# Altium schematic sheet main.SchDoc
size A
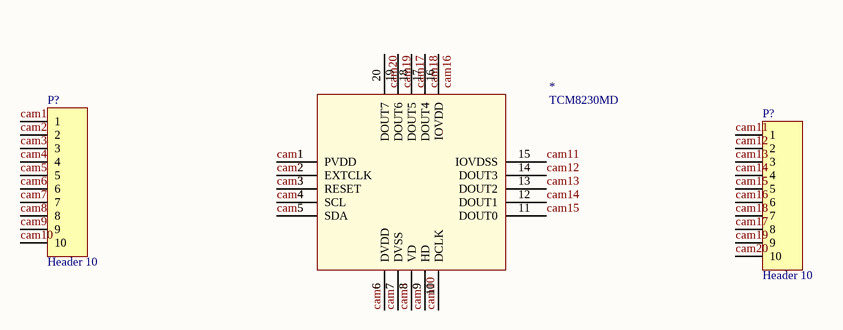
[diagram p0: main.SchDoc]

## Parts
(Parts that share a designator on the sheet are numbered #1, #2 ... from top to bottom, then left to right.)
*  TCM8230MD
P?#1  Header 10  [HDR1X10]
P?#2  Header 10  [HDR1X10]

## Nets
cam1: *.1(PVDD) P?#1.1
cam2: *.2(EXTCLK) P?#1.2
cam3: *.3(RESET) P?#1.3
cam4: *.4(SCL) P?#1.4
cam5: *.5(SDA) P?#1.5
cam6: *.6(DVDD) P?#1.6
cam7: *.7(DVSS) P?#1.7
cam8: *.8(VD) P?#1.8
cam9: *.9(HD) P?#1.9
cam10: *.10(DCLK) P?#1.10
cam11: *.15(IOVDSS) P?#2.1
cam12: *.14(DOUT3) P?#2.2
cam13: *.13(DOUT2) P?#2.3
cam14: *.12(DOUT1) P?#2.4
cam15: *.11(DOUT0) P?#2.5
cam16: *.16(IOVDD) P?#2.6
cam17: *.18(DOUT5) P?#2.8
cam18: *.17(DOUT4) P?#2.7
cam19: *.19(DOUT6) P?#2.9
cam20: *.20(DOUT7) P?#2.10

## Library data of the parts
P?#1 P?#2 = Header 10: Header, 10-Pin; LatestRevisionDate: 17-Jul-2002; LatestRevisionNote: Re-released for DXP Platform.; Publisher: Altium Limited